# EAGLE design Main Board (EAGLE 7.1.0)
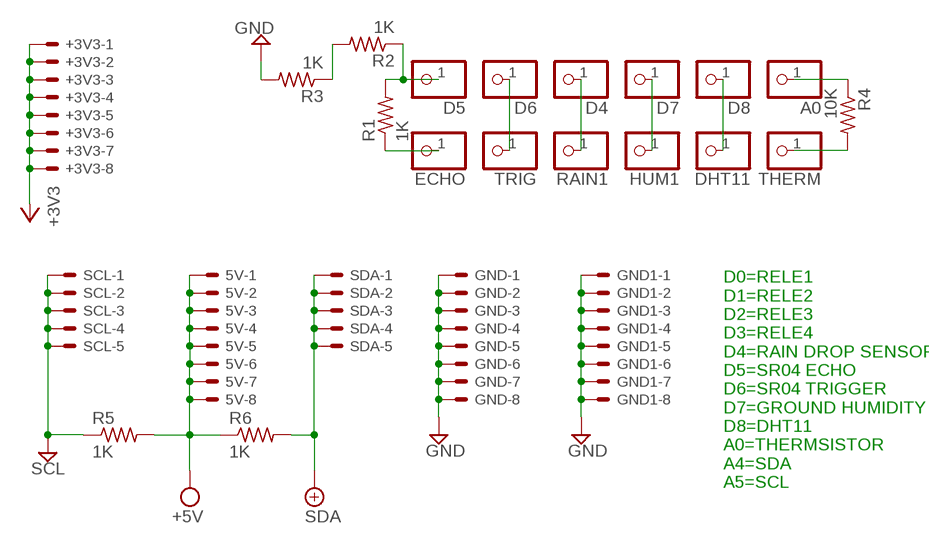
[diagram p0: schematic, sheet 1]

## Parts
5V  22-23-2081  [22-23-2081]
+3V3  22-23-2081  [22-23-2081]
A0  PINHD-1X1  [1X01]
D4  PINHD-1X1  [1X01]
D5  PINHD-1X1  [1X01]
D6  PINHD-1X1  [1X01]
D7  PINHD-1X1  [1X01]
D8  PINHD-1X1  [1X01]
DHT11  PINHD-1X1  [1X01]
ECHO  PINHD-1X1  [1X01]
GND  22-23-2081  [22-23-2081]
GND1  22-23-2081  [22-23-2081]
HUM1  PINHD-1X1  [1X01]
R1  1K  R-US_0204/7  [0204/7]
R2  1K  R-US_0204/7  [0204/7]
R3  1K  R-US_0204/7  [0204/7]
R4  10K  R-US_0204/7  [0204/7]
R5  1K  R-US_0204/7  [0204/7]
R6  1K  R-US_0204/7  [0204/7]
RAIN1  PINHD-1X1  [1X01]
SCL  22-23-2051  [22-23-2051]
SDA  22-23-2051  [22-23-2051]
THERM  PINHD-1X1  [1X01]
TRIG  PINHD-1X1  [1X01]

## Nets
+3V3: +3V3.1 +3V3.2 +3V3.3 +3V3.4 +3V3.5 +3V3.6 +3V3.7 +3V3.8
+5V: 5V.1 5V.2 5V.3 5V.4 5V.5 5V.6 5V.7 5V.8 R5.2 R6.1
ECHO: ECHO.1 R1.1
GND: GND1.1 GND1.2 GND1.3 GND1.4 GND1.5 GND1.6 GND1.7 GND1.8 GND.1 GND.2 GND.3 GND.4 GND.5 GND.6 GND.7 GND.8 R3.2
GND1: R2.2 R3.1
GND3: R5.1 SCL.1 SCL.2 SCL.3 SCL.4 SCL.5 ; supply symbol labelled SCL
GPIO24: D5.1 R1.2 R2.1
N$1: D6.1 TRIG.1
N$2: A0.1 R4.1
N$3: R4.2 THERM.1
N$4: D4.1 RAIN1.1
N$5: D7.1 HUM1.1
N$6: D8.1 DHT11.1
SDA: R6.2 SDA.1 SDA.2 SDA.3 SDA.4 SDA.5

## Notes on the sheet
- D0=RELE1
  D1=RELE2
  D2=RELE3
  D3=RELE4
  D4=RAIN DROP SENSOR
  D5=SR04 ECHO
  D6=SR04 TRIGGER
  D7=GROUND HUMIDITY
  D8=DHT11
  A0=THERMSISTOR
  A4=SDA
  A5=SCL

## Library data of the parts
5V +3V3 GND GND1 = con-molex:22-23-2081: .100" (2.54mm) Center Header - 8 Pin; MF: MOLEX; MPN: 22-23-2081; OC_FARNELL: 1756826; OC_NEWARK: 01C7592
A0 D4-D8 DHT11 ECHO HUM1 RAIN1 THERM TRIG = pinhead:PINHD-1X1: PIN HEADER
R1-R6 = resistor:R-US_: RESISTOR, American symbol
SCL SDA = con-molex:22-23-2051: .100" (2.54mm) Center Header - 5 Pin; MF: MOLEX; MPN: 22-23-2051; OC_FARNELL: 1462952; OC_NEWARK: 38C9178

## Board
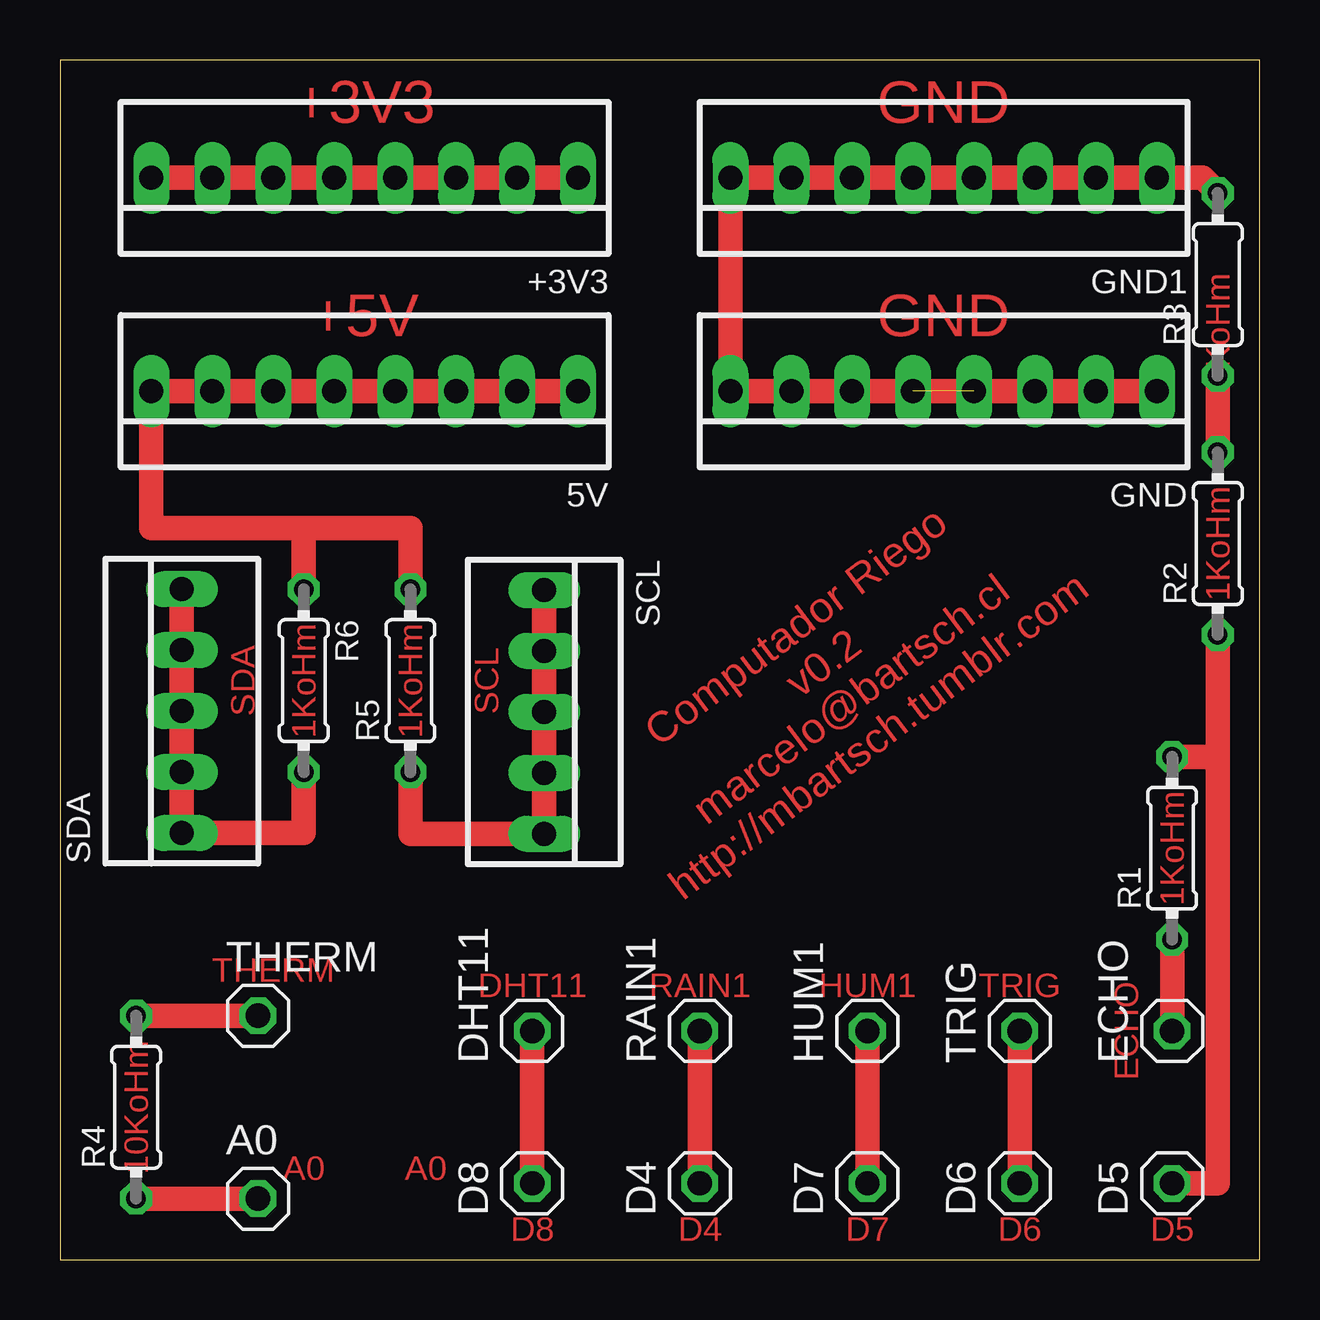
[diagram p1: board, top side]

Size 50 x 50 mm. Coordinates in mm from the lower left corner, seen from the top.
Outline: 0,0 50,0 50,50 0,50 0,0
Copper layers (1*16): Top 0.035mm / dielectric 1.5mm / Bottom 0.035mm
Design rules "default *": minimum track width 10mil, minimum drill 24mil, track to track 8mm, track to pad 8mm, pad to pad 8mm, via to via 8mm, smd to smd 8mil, copper to edge 40mil, drill to drill 8mil, minimum pad ring 10mil, minimum via ring 8mil, stop-mask expansion 4mil, vias tented up to drill 0mil, thermal gap 10mil

### Footprints (pad centres in the part's own frame; a part is rotated, then mirrored left to right if it is on the bottom)
22-23-2081 = drill 1 long: 1 -8.89,0; 2 -6.35,0; 3 -3.81,0; 4 -1.27,0; 5 1.27,0; 6 3.81,0; 7 6.35,0; 8 8.89,0
1X01 = drill 1.016 octagon: 1 0,0
0204/7 = drill 0.813 octagon: 1 -3.81,0; 2 3.81,0
22-23-2051 = drill 1 long: 1 -5.08,0; 2 -2.54,0; 3 0,0; 4 2.54,0; 5 5.08,0

### Placement (x,y rotation side)
5V  12.7,36.2 180 top
+3V3  12.7,45.09 180 top
A0  8.26,2.54 0 top
D4  26.67,3.17 90 top
D5  46.35,3.17 90 top
D6  40.01,3.17 90 top
D7  33.66,3.17 90 top
D8  19.68,3.17 90 top
DHT11  19.68,9.53 90 top
ECHO  46.35,9.53 90 top
GND  36.83,36.2 180 top
GND1  36.83,45.09 180 top
HUM1  33.66,9.53 90 top
R1  46.35,17.14 90 top
R2  48.26,29.84 90 top
R3  48.26,40.64 90 top
R4  3.17,6.35 90 top
R5  14.61,24.13 90 top
R6  10.16,24.13 270 top
RAIN1  26.67,9.53 90 top
SCL  20.18,22.82 270 top
SDA  5.08,22.86 90 top
THERM  8.26,10.16 0 top
TRIG  40.01,9.53 90 top

### Tracks (layer width: path | path; a pad name or v marks a point on that pad's centre or on a via)
+3V3
  Top 1.016: +3V3.8 +3V3.7 +3V3.6 +3V3.5 +3V3.4 +3V3.3 +3V3.2 +3V3.1
+5V
  Top 1.016: 5V.1 5V.2 5V.3 5V.4 5V.5 5V.6 5V.7 5V.8 3.81,30.48 10.16,30.48 | R6.1 10.16,30.48 | R5.2 14.61,30.48 10.16,30.48
ECHO
  Top 1.016: R1.1 ECHO.1
GND  (1 unrouted)
  Top 1.016: R3.2 47.62,45.09 GND1.1 GND1.2 GND1.3 GND1.4 GND1.5 GND1.6 GND1.7 GND1.8 GND.8 GND.7 GND.6 GND.4 GND.3 GND.2 GND.1
GND1
  Top 1.016: R2.2 R3.1
GND3
  Top 1.016: R5.1 14.61,17.75 SCL.5 SCL.4 SCL.3 SCL.2 SCL.1
GPIO24
  Top 1.016: R2.1 48.26,20.95 | 48.26,20.95 48.26,3.17 D5.1 | R1.2 48.26,20.95
N$1
  Top 1.016: TRIG.1 D6.1
N$2
  Top 1.016: R4.1 A0.1
N$3
  Top 1.016: THERM.1 R4.2
N$4
  Top 1.016: RAIN1.1 D4.1
N$5
  Top 1.016: HUM1.1 D7.1
N$6
  Top 1.016: DHT11.1 D8.1
N$7
  pour Top (isolate 0.305): 2.54,46.99 22.86,46.99 22.86,43.18 2.54,43.18
N$8
  pour Top (isolate 0.305): 2.54,35.56 2.54,38.1 22.86,38.1 22.86,34.29 2.54,34.29
N$9
  pour Top (isolate 0.305): 26.67,44.45 26.67,46.99 46.99,46.99 46.99,43.18 26.67,43.18
N$10
  pour Top (isolate 0.305): 26.67,35.56 26.67,38.1 46.99,38.1 46.99,34.29 26.67,34.29
SDA
  Top 1.016: R6.2 10.16,17.78 SDA.1 SDA.2 SDA.3 SDA.4 SDA.5

### Text on the board
Top: +3V3 | GND | +5V | GND | 1KoHm | 1KoHm | SDA | 1KoHm | 1KoHm | SCL | Computador Riego / v0.2 / marcelo@bartsch.cl / http://mbartsch.tumblr.com | 1KoHm | THERM | DHT11 | RAIN1 | HUM1 | TRIG | ECHO | 10KoHm | A0 | A0 | D8 | D4 | D7 | D6 | D5